# EAGLE design ministep (EAGLE 5.12)
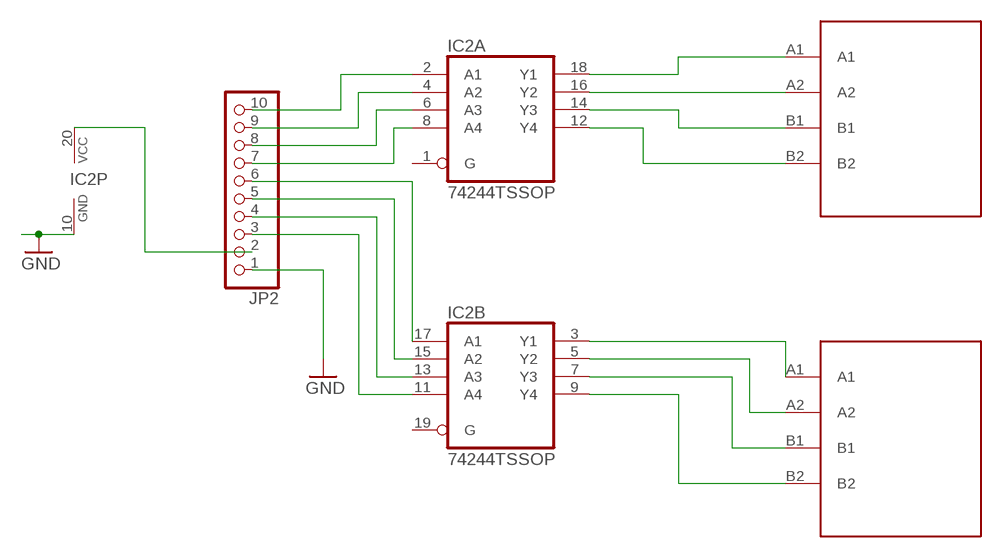
[diagram p0: schematic, sheet 1]

## Parts
IC2  74244TSSOP  [TSSOP20]
JP2  PINHD-1X10  [1X10]
U$1  MINISTEP  [MINISTEP]
U$2  MINISTEP  [MINISTEP]

## Nets
GND: IC2.10(P:GND) JP2.1
N$1: IC2.18(A:Y1) U$1.A1
N$2: IC2.16(A:Y2) U$1.A2
N$3: IC2.14(A:Y3) U$1.B1
N$4: IC2.12(A:Y4) U$1.B2
N$5: IC2.3(B:Y1) U$2.A1
N$6: IC2.5(B:Y2) U$2.A2
N$7: IC2.7(B:Y3) U$2.B1
N$8: IC2.9(B:Y4) U$2.B2
N$10: IC2.20(P:VCC) JP2.2
N$12: IC2.2(A:A1) JP2.10
N$13: IC2.4(A:A2) JP2.9
N$14: IC2.6(A:A3) JP2.8
N$15: IC2.8(A:A4) JP2.7
N$16: IC2.17(B:A1) JP2.6
N$17: IC2.15(B:A2) JP2.5
N$18: IC2.13(B:A3) JP2.4
N$19: IC2.11(B:A4) JP2.3
Unconnected: IC2.1(A:G) IC2.19(B:G)

## Library data of the parts
IC2 = matt:74*244: Octal BUFFER and LINE DRIVER, 3-state
JP2 = pinhead:PINHD-1X10: PIN HEADER
U$1 U$2 = matt:MINISTEP

## Board
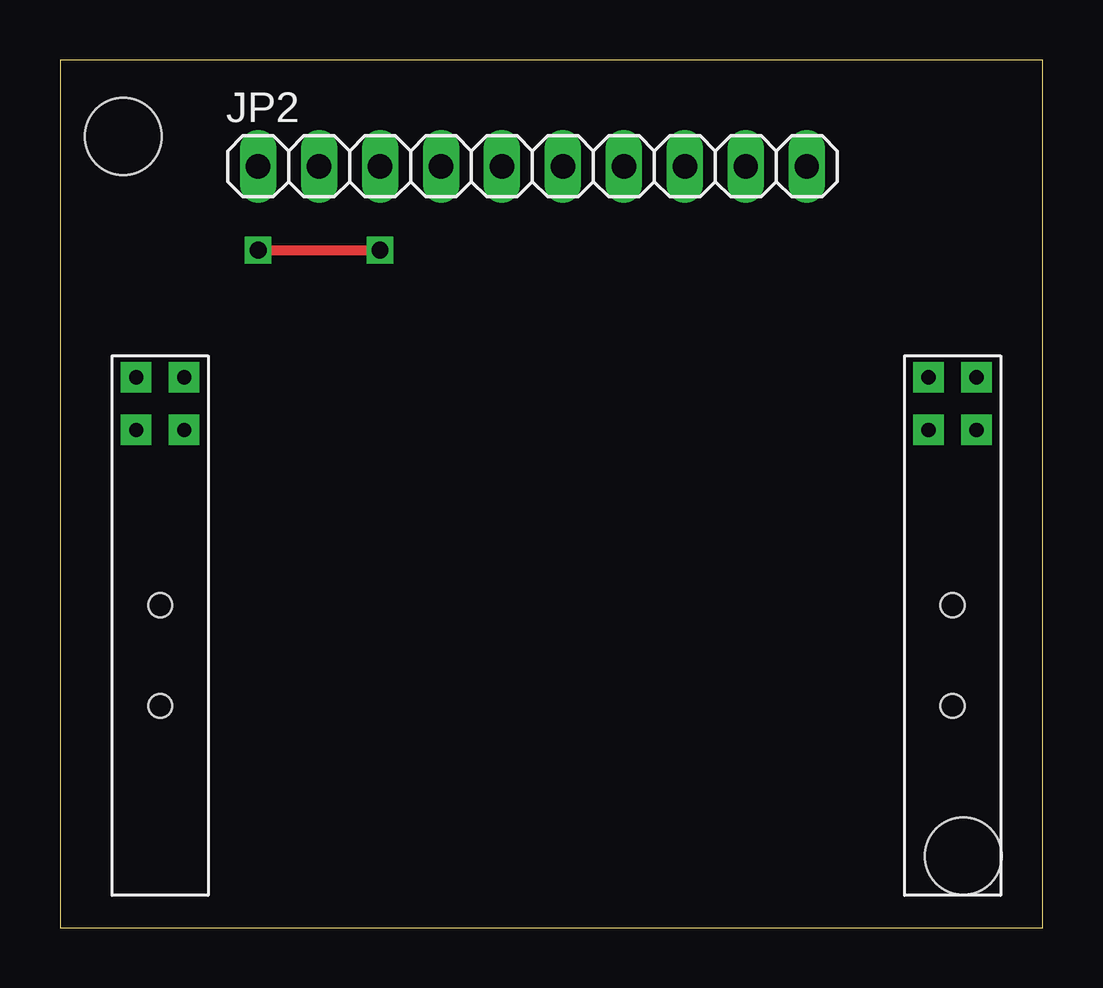
[diagram p1: board, top side]
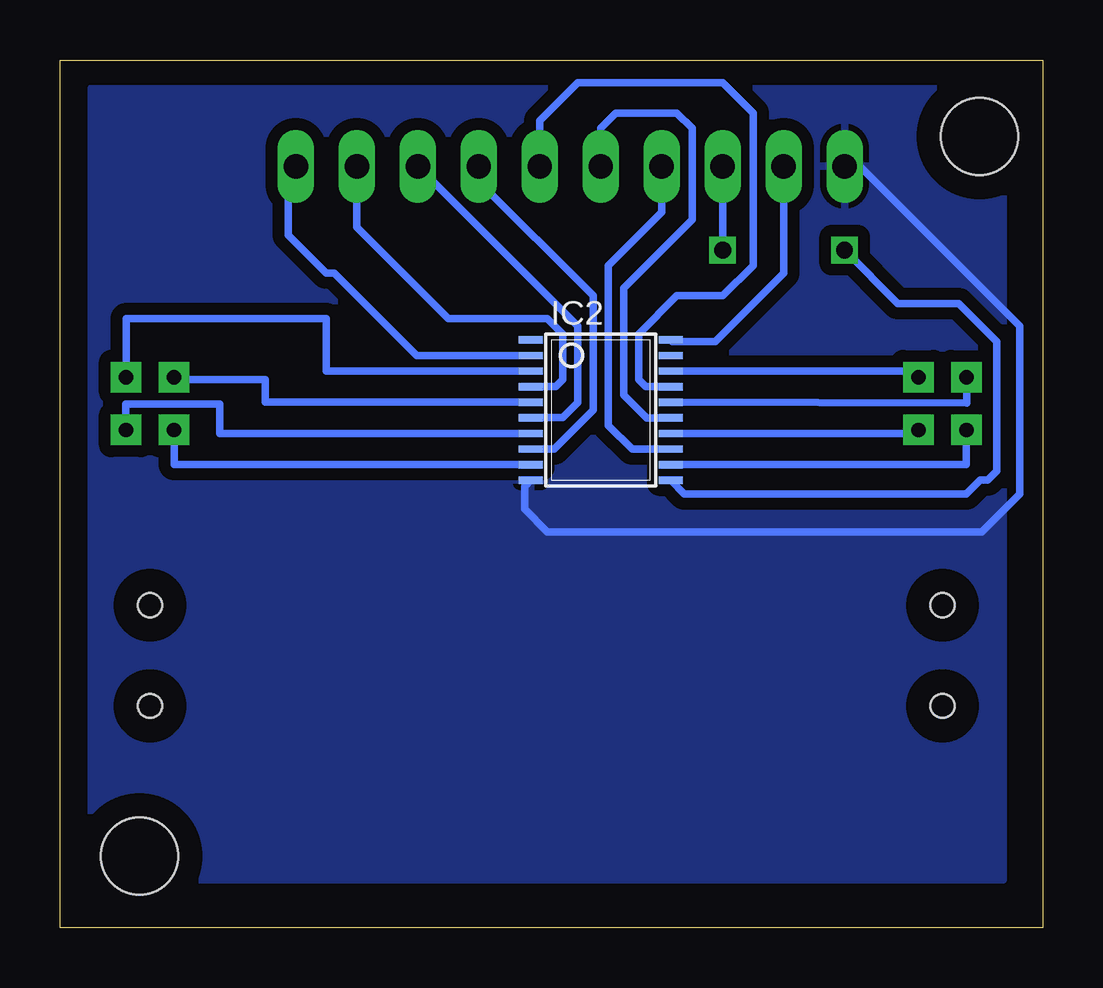
[diagram p2: board, bottom side, seen from below]

Size 40.95 x 36.19 mm. Coordinates in mm from the lower left corner, seen from the top.
Outline: 0,0 40.95,0 40.95,36.19 0,36.19 0,0
Copper layers (1*16): Top 0.035mm / dielectric 1.5mm / Bottom 0.035mm
Design rules "default": minimum track width 10mil, minimum drill 24mil, track to track 8mil, track to pad 8mil, pad to pad 8mil, via to via 8mil, smd to smd 8mil, copper to edge 40mil, drill to drill 8mil, minimum pad ring 10mil, minimum via ring 8mil, stop-mask expansion 4mil, vias tented up to drill 0mil, thermal gap 10mil
Holes 3.2 mm at 2.63,33 37.63,3

### Footprints (pad centres in the part's own frame; a part is rotated, then mirrored left to right if it is on the bottom)
TSSOP20 = smd 0.305 x 0.991: 1 -2.925,-2.918; 2 -2.275,-2.918; 3 -1.625,-2.918; 4 -0.975,-2.918; 5 -0.325,-2.918; 6 0.325,-2.918; 7 0.975,-2.918; 8 1.625,-2.918; 9 2.275,-2.918; 10 2.925,-2.918; 11 2.925,2.918; 12 2.275,2.918; 13 1.625,2.918; 14 0.975,2.918; 15 0.325,2.918; 16 -0.325,2.918; 17 -0.975,2.918; 18 -1.625,2.918; 19 -2.275,2.918; 20 -2.925,2.918
1X10 = drill 1.016 long: 1 -11.43,0; 2 -8.89,0; 3 -6.35,0; 4 -3.81,0; 5 -1.27,0; 6 1.27,0; 7 3.81,0; 8 6.35,0; 9 8.89,0; 10 11.43,0
MINISTEP = drill 0.6 pad 1.27 square: A1 -0.1,2; A2 -0.1,0; B1 2.1,2; B2 2.1,0 | hole 1: 9.4,1; 13.6,1

### Placement (x,y rotation side)
IC2  18.42,21.59 270 bottom
JP2  19.69,31.75 0 top
U$1  3.17,22.86 270 top
U$2  36.2,22.86 270 top

### Tracks (layer width: path | path; a pad name or v marks a point on that pad's centre or on a via)
GND
  Bottom 0.305: JP2.1 7.62,31.75 0.95,25.08 0.95,18.1 2.54,16.51 20.64,16.51 21.59,17.46 21.59,18.41 IC2.10
  pour Bottom (isolate 0.5): 1.64,35 39.63,35 39.63,2 1.64,2
N$1
  Bottom 0.305: IC2.18 5.17,23.21 U$1.A1
N$2
  Bottom 0.305: IC2.16 3.16,21.88 U$1.A2
N$3
  Bottom 0.305: IC2.14 5.17,20.61 U$1.B1
N$4
  Bottom 0.305: IC2.12 3.17,19.32 U$1.B2
N$5
  Bottom 0.305: IC2.3 29.85,23.21 29.85,25.4 38.2,25.4 U$2.A1
N$6
  Bottom 0.305: IC2.5 32.38,21.91 32.38,22.86 36.2,22.86 U$2.A2
N$7
  Bottom 0.305: IC2.7 34.29,20.61 34.3,21.83 38.2,21.83 U$2.B1
N$8
  Bottom 0.305: IC2.9 36.2,19.32 U$2.B2
N$10
  Bottom 0.305: JP2.2 10.79,27.3 13.65,24.45 15.43,24.45 IC2.20
N$12
  Bottom 0.305: IC2.2 26.09,23.86 29.53,27.3 29.85,27.3 31.43,28.89 31.43,31.43 JP2.10
N$13
  Bottom 0.305: IC2.4 20.3,22.57 20,22.86 20,24.77 20.64,25.4 24.77,25.4 28.58,29.21 JP2.9
N$14
  Bottom 0.305: JP2.8 19.37,25.08 19.37,21.91 20,21.27 IC2.6
N$15
  Bottom 0.305: IC2.8 20.36,19.96 18.73,21.59 18.73,26.35 23.5,31.11 JP2.7
N$16
  Bottom 0.305: IC2.17 16.53,22.57 16.83,22.86 16.83,24.77 15.24,26.35 13.33,26.35 12.06,27.62 12.06,33.97 13.33,35.24 19.37,35.24 19.53,35.08 20.96,33.66 JP2.6
N$17
  Bottom 0.305: IC2.15 16.5,21.27 17.46,22.23 17.46,26.67 14.61,29.53 14.61,33.34 15.24,33.97 17.78,33.97 18.42,33.34 JP2.5
N$18
  Bottom 0.305: IC2.13 17.11,19.96 18.1,20.95 18.1,27.62 15.88,29.84 JP2.4
N$19  (via drill 0.7)
  Top 0.406: v8.26,28.26 v13.33,28.26
  Bottom 0.305: v13.33,28.26 JP2.3 | v8.26,28.26 6.03,26.04 3.49,26.04 1.91,24.45 1.91,19.05 2.29,18.66 2.61,18.66 3.17,18.1 14.93,18.1 IC2.11

### Text on the board
bRestrict: ministep